# Altium project 03_POWER.PrjPCB
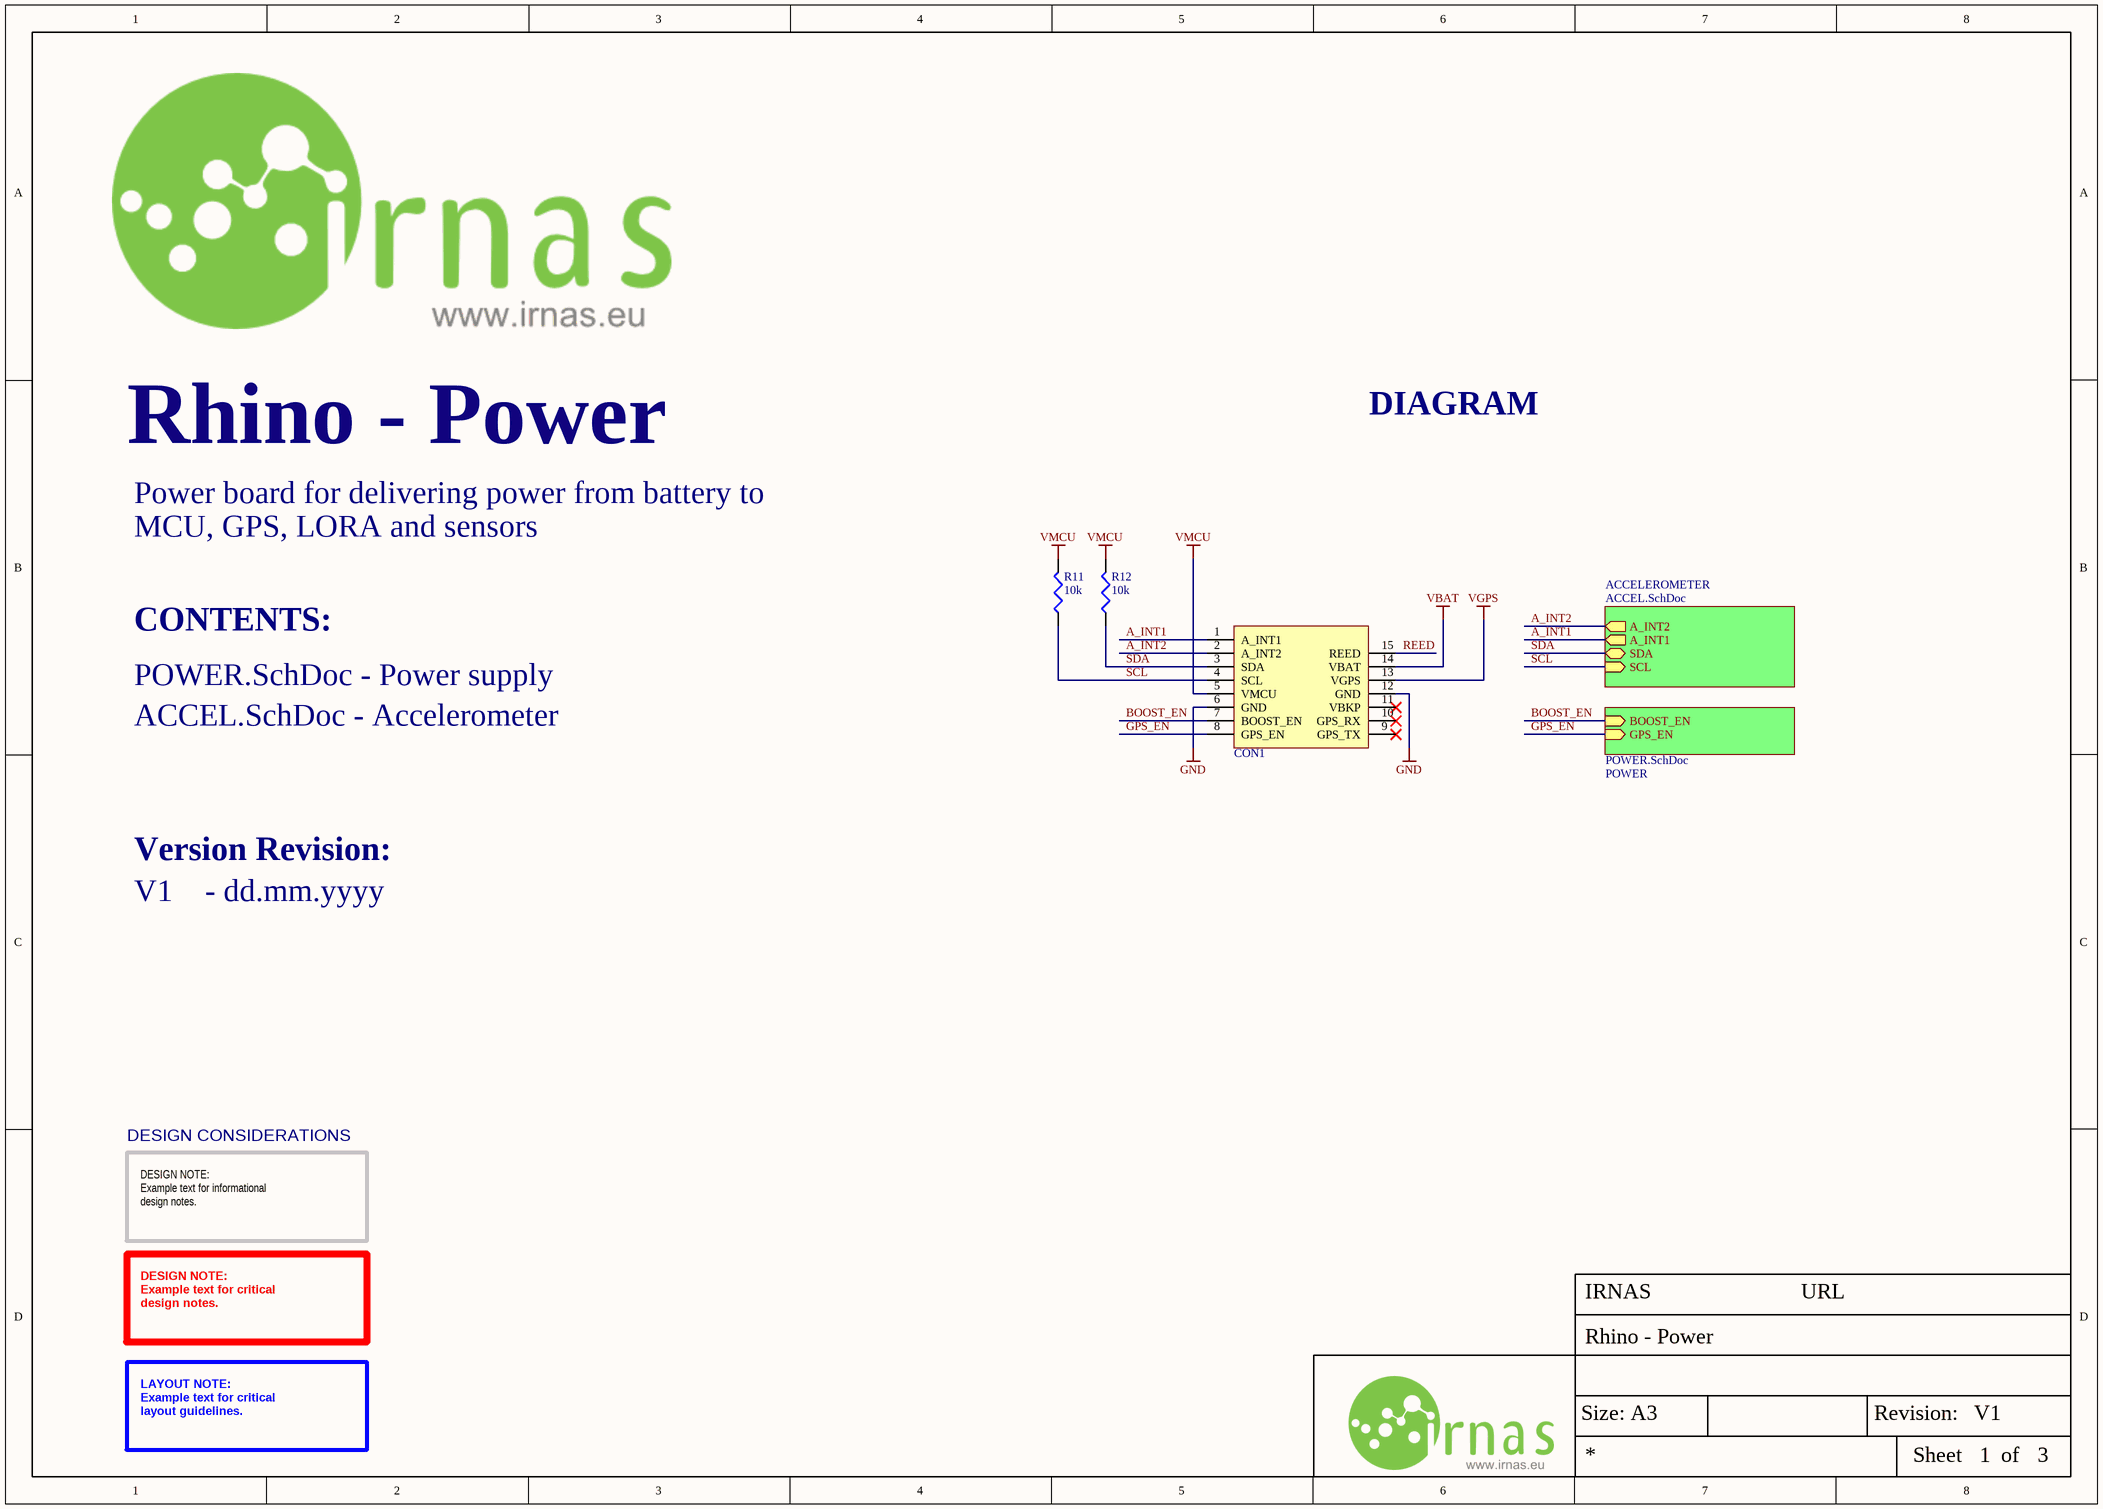
[diagram p0: MAIN_POWER.SchDoc]
Company: IRNAS; CreateDate: 13.05.2019; PCBDesigner: Aleksej Cegner; ProjectTitle: Rhino - Power; RevisionDate: dd.mm.yyyy; Version: V1; Website: URL
3 sheets, 36 parts. Net scope: hierarchical (ports join the sheet entries above them; power ports are global).
Board file: POWER.PcbDoc
Sheets:
  MAIN_POWER.SchDoc
    POWER = POWER.SchDoc
    ACCELEROMETER = ACCEL.SchDoc

## Sheet MAIN_POWER.SchDoc
size A3; DocumentNumber: 1; SheetNumber: 1; SheetTotal: 3

### Parts
CON1  Between PCB connection  [SmartParks_Rhino]  (value not drawn)
R11  10k  [RES0402]
R12  10k  [RES0402]

### Sub-sheets
ACCELEROMETER = ACCEL.SchDoc: A_INT1 (out), SCL (in), SDA (bidir), A_INT2 (out)
POWER = POWER.SchDoc: GPS_EN (in), BOOST_EN (in)

### Nets
GND: CON1.6(GND) CON1.12(GND)
VBAT: CON1.14(VBAT)
VGPS: CON1.13(VGPS)
VMCU: CON1.5(VMCU) R11.2 R12.2
A_INT1: CON1.1(A_INT1) ; sheet ACCELEROMETER/A_INT1
A_INT2: CON1.2(A_INT2) ; sheet ACCELEROMETER/A_INT2
BOOST_EN: CON1.7(BOOST_EN) ; sheet POWER/BOOST_EN
GPS_EN: CON1.8(GPS_EN) ; sheet POWER/GPS_EN
REED: CON1.15(REED)
SCL: CON1.4(SCL) R11.1 ; sheet ACCELEROMETER/SCL
SDA: CON1.3(SDA) R12.1 ; sheet ACCELEROMETER/SDA

Not connected (* = marked no-connect by the designer): CON1 9(GPS_TX)* 10(GPS_RX)* 11(VBKP)*

### Notes on the sheet
- DIAGRAM
- Power board for delivering power from battery to
- MCU, GPS, LORA and sensors
- CONTENTS:
- POWER.SchDoc - Power supply
- ACCEL.SchDoc - Accelerometer
- Version Revision:
- V1    - dd.mm.yyyy
- DESIGN CONSIDERATIONS
- DESIGN NOTE:
  Example text for informational
  design notes.
- DESIGN NOTE:
  Example text for critical
  design notes.
- LAYOUT NOTE:
  Example text for critical
  layout guidelines.
- Size: A3
- Revision:
- Sheet
- of

### Library data of the parts
CON1 = SmartParks_Rhino
R11 R12 = R - 10k/0402: MULTICOMP         MCWR04X1002FTL             SMD Chip Resistor, Thick Film, 10 kohm, 50 V, 0402 [1005 Metric], 62.5 mW,  1%, MCWR Series; IRNAS Part No.: I-100014; Resistance: 10kR; Voltage Rating: 50V; Power Rating: 62.5mW; Temperature Coefficient: 100ppm/°C; Supplier 1: Farnell; Manufacturer: Multicomp; Manufacturer Part Number: MCWR04X1002FTL; Stock 1: 602609; Pricing 1: 10=0.0029, 100=0.0017, 500=0.0012, 2500=0.001, 5000=0.0008 (EUR); Case/Package: 0402; Case Code (Metric): 1005; Case Code (Imperial): 0402; Packaging: Cut Tape; Composition: Thick Film; Tolerance: 1%; Voltage Rating (DC): 50V; REACH SVHC: No SVHC; ComponentLink1URL: http://www.farnell.com/datasheets/1849611.pdf; ComponentLink1Description: http://www.farnell.com/datasheets/1849611.pdf; Supplier Part Number 1: 2447096

## Sheet POWER.SchDoc
size A3; DocumentNumber: 2; SheetNumber: 2; SheetTotal: 3
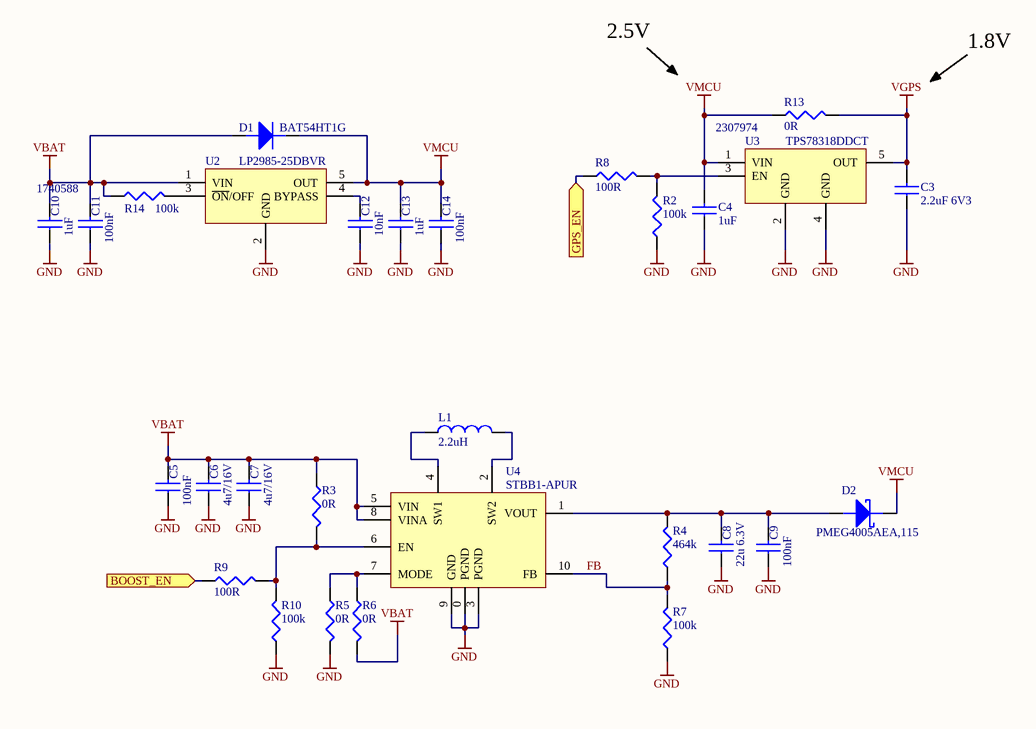
[diagram p1: POWER.SchDoc]

### Parts
C3  2.2uF 6V3  [CAP0402]
C4  1uF  [CAP0402]
C5  100nF  [CAP0402]
C6  4u7/16V  [CAP0603]
C7  4u7/16V  [CAP0603]
C8  22u 6.3V  [CAP0805]
C9  100nF  [CAP0402]
C10  1uF  Supplier Part Number 1: 1740588  [CAP0402]
C11  100nF  [CAP0402]
C12  10nF  [CAP0402]
C13  1uF  [CAP0402]
C14  100nF  [CAP0402]
D1  BAT54HT1G  [SOD-323 2L]
D2  PMEG4005AEA,115  [SOD-323 2L]
L1  2.2uH  [IND2.3X1.7]
R2  100k  [RES0402]
R3  0R  [RES0402]
R4  464k  [RES0402]
R5  0R  [RES0402]
R6  0R  [RES0402]
R7  100k  [RES0402]
R8  100R  [RES0402]
R9  100R  [RES0402]
R10  100k  [RES0402]
R13  0R  [RES0402]
R14  100k  [RES0402]
U2  LP2985-25DBVR  [SOT23-5]
U3  TPS78318DDCT  Supplier Part Number 1: 2307974  [SOT23-5]
U4  STBB1-APUR  [DFN-10]

### Ports
BOOST_EN (in), GPS_EN (in)

### Nets
GND: C3.1 C4.1 C5.1 C6.1 C7.1 C8.1 C9.1 C10.1 C11.1 C12.1 C13.1 C14.1 R2.1 R5.2 R7.1 R10.1 U2.2(GND) U3.2(GND) U3.4(GND) U4.0(PGND) U4.3(PGND) U4.9(GND)
VBAT: C5.2 C6.2 C7.2 C10.2 C11.2 D1.2(ANODE) R3.1 R6.2 R14.1 U2.1(VIN) U4.5(VIN) U4.8(VINA)
VGPS: C3.2 R13.2 U3.5(OUT)
VMCU: C4.2 C13.2 C14.2 D1.1(cathode) D2.1(cathode) R13.1 U2.5(OUT) U3.1(VIN)
BOOST_EN: R9.1 ; port BOOST_EN
FB: R4.1 R7.2 U4.10(FB)
GPS_EN: R8.1 ; port GPS_EN
NetC8_2: C8.2 C9.2 D2.2(ANODE) R4.2 U4.1(VOUT)
NetC12_2: C12.2 U2.4(BYPASS)
NetL1_1: L1.1 U4.4(SW1)
NetL1_2: L1.2 U4.2(SW2)
NetR2_2: R2.2 R8.2 U3.3(EN)
NetR3_2: R3.2 R9.2 R10.2 U4.6(EN)
NetR5_1: R5.1 R6.1 U4.7(MODE)
NetR14_2: R14.2 U2.3(~{ON}/OFF)

### Notes on the sheet
- 2.5V
- 1.8V
- Size: A3
- Revision:
- Sheet
- of

### Library data of the parts
C3 = C - 2.2uF/6V3/0402: CAP CER 2.2UF 6.3V 20% X5R 0402; Manufacturer: Murata; Manufacturer Part Number: GRM155R60J225ME15D; IRNAS Part No.: /; Material: Ceramic; Stock 1: 0; Pricing 1: 10=0.118, 100=0.0494, 500=0.031, 2500=0.0213, 5000=0.0163 (EUR); Mount: Surface Mount; Case/Package: 0402; Case Code (Metric): 1005; Case Code (Imperial): 0402; Min Operating Temperature: -55°C; Max Operating Temperature: 85°C; Packaging: Tape and Reel; Capacitance: 2.2uF; Tolerance: 20%; Package Quantity: 10000; Voltage Rating: 6.3V; Voltage Rating (DC): 6.3V; Dielectric: X5R; Termination: SMD/SMT; Voltage: 6.3V; Length: 1mm; Height: 0.5mm; Width: 0.02inch; Thickness: 0.022inch; Depth: 0.5mm; Radiation Hardening: No; REACH SVHC: No SVHC; Lead Free: Lead Free; ComponentLink1URL: https://datasheet.ciiva.com/29149/450128-da-01-de-vs-kondens-grm155-r60j-225me15d-29149006.pdf; ComponentLink1Description: https://datasheet.ciiva.com/29149/450128-da-01-de-vs-kondens-grm155-r60j-225me15d-29149006.pdf; ComponentLink2URL: https://datasheet.ciiva.com/46418/1754686-46418042.pdf; ComponentLink2Description: https://datasheet.ciiva.com/46418/1754686-46418042.pdf; ComponentLink3URL: https://datasheet.ciiva.com/17454/c02e-17454956.pdf; ComponentLink3Description: https://datasheet.ciiva.com/17454/c02e-17454956.pdf; ComponentLink4URL: https://datasheet.ciiva.com/235/partnumbering-e-01-235009.pdf; ComponentLink4Description: https://datasheet.ciiva.com/235/partnumbering-e-01-235009.pdf; ComponentLink5URL: https://datasheet.ciiva.com/2989/c02e-2989361.pdf; ComponentLink5Description: https://datasheet.ciiva.com/2989/c02e-2989361.pdf; ComponentLink6URL: https://datasheet.ciiva.com/235/partnumbering-e-01-235010.pdf; ComponentLink6Description: https://datasheet.ciiva.com/235/partnumbering-e-01-235010.pdf; ComponentLink7URL: https://datasheet.ciiva.com/235/partnumbering-e-01-235011.pdf; ComponentLink7Description: https://datasheet.ciiva.com/235/partnumbering-e-01-235011.pdf; Supplier 1: Farnell; Supplier Part Number 1: 2362088
C4 C10 C13 = C - 1uF/0402: CAP CER 1UF 10V 20% X5R 0402; Manufacturer: Murata; Manufacturer Part Number: GRM155R61A105ME15D; IRNAS Part No.: /; Stock 1: 0; Pricing 1: 10=0.0379, 100=0.0266, 500=0.0156, 2500=0.0098, 5000=0.0083 (EUR); Mount: Surface Mount; Case/Package: 0402; Case Code (Metric): 1005; Case Code (Imperial): 0402; Min Operating Temperature: -55°C; Max Operating Temperature: 85°C; Capacitance: 1uF; Tolerance: 20%; Voltage Rating: 10V; Packaging: Tape and Reel; Package Quantity: 1; Dielectric: X5R; Voltage: 10V; Voltage Rating (DC): 10V; Length: 1mm; Height: 0.5mm; Width: 0.02inch; Thickness: 0.022inch; Depth: 0.5mm; Radiation Hardening: No; REACH SVHC: No SVHC; Lead Free: Lead Free; ComponentLink1URL: https://datasheet.ciiva.com/164/product-164665.pdf; ComponentLink1Description: https://datasheet.ciiva.com/164/product-164665.pdf; ComponentLink2URL: https://datasheet.ciiva.com/11616/product-11616508.pdf; ComponentLink2Description: https://datasheet.ciiva.com/11616/product-11616508.pdf; ComponentLink3URL: https://datasheet.ciiva.com/46418/1769893-46418047.pdf; ComponentLink3Description: https://datasheet.ciiva.com/46418/1769893-46418047.pdf; ComponentLink4URL: https://datasheet.ciiva.com/164/partnumbering-e-01-164666.pdf; ComponentLink4Description: https://datasheet.ciiva.com/164/partnumbering-e-01-164666.pdf; ComponentLink5URL: https://datasheet.ciiva.com/164/partnumbering-e-01-164667.pdf; ComponentLink5Description: https://datasheet.ciiva.com/164/partnumbering-e-01-164667.pdf; Supplier 1: Farnell
  C4 C13: Supplier Part Number 1: 1740588
C5 C9 C11 C14 = C - 100nF/0402: MULTICOMP         MC0402X104J160CT             SMD Multilayer Ceramic Capacitor, 0402 [1005 Metric], 0.1 F, 16 V,  5%, X5R, MC Series                          New; IRNAS Part No.: /; Voltage Rating: 16V; Supplier 1: Farnell; Manufacturer: Multicomp; Manufacturer Part Number: MC0402X104J160CT; Stock 1: 3230; Pricing 1: 10=0.0139, 100=0.0108, 500=0.0076, 2500=0.0051, 5000=0.0038 (EUR); Case Code (Metric): 1005; Case Code (Imperial): 0402; Min Operating Temperature: -55°C; Max Operating Temperature: 85°C; Capacitance: 100nF; Dielectric: X5R; Packaging: Tape and Reel; Tolerance: 5%; Voltage Rating (DC): 16V; REACH SVHC: No SVHC; ComponentLink1URL: http://www.farnell.com/datasheets/2117933.pdf; ComponentLink1Description: http://www.farnell.com/datasheets/2117933.pdf; ComponentLink2URL: http://www.farnell.com/datasheets/2117900.pdf; ComponentLink2Description: http://www.farnell.com/datasheets/2117900.pdf; Supplier Part Number 1: 2627419
C6 C7 = C - 4u7  16V 0603: MURATA - GRM188R61C475KAAJD - CAP, MLCC, X5R, 4.7UF, 16V, 0603; IRNAS Part No.: I-200001; Ceramic Capacitor Case: 0603 [1608 Metric]; Capacitance: 4.7; Voltage Rating: 16; Capacitance Tolerance: ± 10%; Dielectric Characteristic: X5; Product Range: GRM Series; SVHC: No SVHC (17-Dec-2015)<!--FANDB--><div class="features-and-benefits-container"><div class="features-and-benefits-desc-container"><span class="features-and-benefits-container-desc">SMD Multilayer Ceramic Capacitor, 0603 [1608 Metric], 4.7 µF, 16 V, ± 10%, X5; Supplier 1: Farnell; Manufacturer: MURATA; Manufacturer Part Number: GRM188R61C475KAAJD; RoHS: YES; Stock 1: 5038; Pricing 1: 10=0.16, 100=0.0929, 500=0.076, 1000=0.0618, 2000=0.0605, 4000=0.0425, 20000=0.0409, 40000=0.0355 (GBP); Packaging: Cut Tape; Operating Temperature Min: -55; Operating Temperature Max: 85; Automotive Qualification Standard: -; MSL: MSL 1 - Unlimited; ComponentLink1URL: http://www.farnell.com/datasheets/2079168.pdf; ComponentLink1Description: http://www.farnell.com/datasheets/2079168.pdf; Supplier Part Number 1: 2611924
C8 = C - 22u 6.3V 0805: MULTICOMP - MC0805X226M6R3CT - CAP, MLCC, X5R, 22UF, 0805; IRNAS Part No.: I-200008; Ceramic Capacitor Case: 0805 [2012 Metric]; Capacitance: 22; Voltage Rating: 6.3; Capacitance Tolerance: ± 20%; Dielectric Characteristic: X5; Product Range: MC Series; SVHC: No SVHC (07-Jul-2017); Capacitor Terminals: SMD; Manufacturer: MULTICOMP; Manufacturer Part Number: MC0805X226M6R3CT; RoHS: YES; Stock 1: 74736; Pricing 1: 5=0.128, 50=0.0738, 250=0.0507, 500=0.042, 1500=0.0358 (GBP); Packaging: Cut Tape; Operating Temperature Min: -55; Operating Temperature Max: 85; Automotive Qualification Standard: -; MSL: -; Capacitance Tolerance ±: ± 20%; Operating Temperature Range: -55°C to +85°C<!--FANDB--><div class="features-and-benefits-container"><div class="features-and-benefits-desc-container"><span class="features-and-benefits-container-desc">SMD Multilayer Ceramic Capacitor, 0805 [2012 Metric], 22 µF, 6.3 V, ± 20%, X5R, MC Series</span></div><div class="features-and-benefits-description"><span class="features-benefits-value">The Multicomp MC series is general purpose MLCC capacitors with X5R dielectric material which provides high electrical precision, stability and reliability. This MLCC capacitor consists of a conducting material and electrodes with high density and high efficiency ceramic condensers.</span></div><div class="features-and-benefits-list"><ul class="features-and-benefits-list-list"><li class="features-and-benefits-list-item">Small size with higher capacitance values</li><li class="features-and-benefits-list-item">0201, 0402, 0603, 0805, 1206, 1210, 1812 case sizes available</li><li class="features-and-benefits-list-item">Capacitance value ranging from 100pF to 220?F</li><li class="features-and-benefits-list-item">Capacitor with lead free termination (pure Tin)</li><li class="features-and-benefits-list-item">High electrical precision, stability and reliability</li><li class="features-and-benefits-list-item">Rated voltage of 4V, 6.3V, 10V, 16V, 25V, 50V</li><li class="features-and-benefits-list-item">Operating temperature of -55°C to +85°C</li><li class="features-and-benefits-list-item">Available in ±10% and ±20; ComponentLink1URL: http://www.farnell.com/datasheets/1901289.pdf; ComponentLink1Description: http://www.farnell.com/datasheets/1901289.pdf; ComponentLink2URL: http://www.farnell.com/datasheets/1932399.pdf; ComponentLink2Description: http://www.farnell.com/datasheets/1932399.pdf; Supplier 1: Farnell; Supplier Part Number 1: 2611932
C12 = C - 10nF/0402: CAP CER 10000PF 16V X7R 0402; Manufacturer: Murata; Manufacturer Part Number: GRM155R71C103KA01D; IRNAS Part No.: /; Tolerance: 10%; Stock 1: 16478; Pricing 1: 10=0.0216, 100=0.0151, 500=0.0104, 2500=0.0069, 5000=0.0056 (EUR); Mount: Surface Mount; Case/Package: 0402; Number of Pins: 2; Case Code (Metric): 1005; Case Code (Imperial): 0402; Min Operating Temperature: -55°C; Max Operating Temperature: 125°C; Package Quantity: 1; Capacitance: 10nF; Voltage Rating: 16V; Packaging: Tape and Reel; Voltage Rating (DC): 16V; Dielectric: X7R; Termination: SMD/SMT; Voltage: 16V; Length: 1mm; Height: 0.5mm; Width: 0.02inch; Thickness: 0.022inch; Depth: 0.5mm; Radiation Hardening: No; REACH SVHC: No SVHC; Lead Free: Lead Free; ComponentLink1URL: https://datasheet.ciiva.com/129/partnumbering-e-01-129774.pdf; ComponentLink1Description: https://datasheet.ciiva.com/129/partnumbering-e-01-129774.pdf; ComponentLink2URL: https://datasheet.ciiva.com/129/partnumbering-e-01-129775.pdf; ComponentLink2Description: https://datasheet.ciiva.com/129/partnumbering-e-01-129775.pdf; ComponentLink3URL: https://datasheet.ciiva.com/129/product-129776.pdf; ComponentLink3Description: https://datasheet.ciiva.com/129/product-129776.pdf; ComponentLink4URL: https://datasheet.ciiva.com/18184/getdatasheetpartid-178863-18184649.pdf; ComponentLink4Description: https://datasheet.ciiva.com/18184/getdatasheetpartid-178863-18184649.pdf; ComponentLink5URL: https://datasheet.ciiva.com/22698/608985-22698415.pdf; ComponentLink5Description: https://datasheet.ciiva.com/22698/608985-22698415.pdf; ComponentLink6URL: https://datasheet.ciiva.com/7937/608985-7937614.pdf; ComponentLink6Description: https://datasheet.ciiva.com/7937/608985-7937614.pdf; Supplier 1: Farnell; Supplier Part Number 1: 3019275
D1 = DS - BAT54HT1G: FAIRCHILD SEMICONDUCTOR - BAT54HT1G - DIODE, SCHOTTKY, 30V, SOD-323; Diode Configuration: Single; Repetitive Reverse Voltage Vrrm Max: 30; Forward Current If(AV): 200; Forward Voltage VF Max: 800; Forward Surge Current Ifsm Max: 600; No. of Pins: 2; Product Range: BAT54 Series; SVHC: No SVHC (15-Jun-2015); Reverse Recovery Time trr Max: 5ns<!--FANDB--><div class="features-and-benefits-container"><div class="features-and-benefits-description"><span class="features-benefits-value">The BAT54HT1G is a Schottky Barrier Diode for general usage and suitable for many different applications.</span></div><div class="features-and-benefits-list"><ul class="features-and-benefits-list-list"><li class="features-and-benefits-list-item">-65 to 150°C Storage temperature range</li><li class="features-and-benefits-list-item">-55 to 150; Supplier 1: Farnell; Manufacturer: FAIRCHILD SEMICONDUCTOR; Manufacturer Part Number: BAT54HT1G; RoHS: YES; Stock 1: 5495; Pricing 1: 1=0.0747, 250=0.065, 500=0.055, 1000=0.045, 3000=0.0349, 9000=0.0279 (GBP); Operating Temperature Max: 150; Diode Case Style: SOD-323; Packaging: Cut Tape; Automotive Qualification Standard: -; MSL: MSL 1 - Unlimited; ComponentLink1URL: http://www.farnell.com/datasheets/2251626.pdf; ComponentLink1Description: http://www.farnell.com/datasheets/2251626.pdf; Supplier Part Number 1: 2453769
D2 = DS - PMEG4005AEA,115: Schottky Rectifier, 40 V, 500 mA, Single; Manufacturer: MICRO COMMERCIAL COMPONENTS; Manufacturer Part Number: SK34A-TP; RoHS: Y-EX; Stock 1: 3770; Pricing 1: 1=0.736, 10=0.574, 100=0.395, 250=0.328, 500=0.309, 1000=0.287, 5000=0.252, 10000=0.214 (GBP); ComponentLink1URL: D:\altium\Altium_Library\Active\Datasheet\PMEG4005AEA.pdf; ComponentLink1Description: Datasheet; Supplier 1: Farnell; Supplier Part Number 1: 8738025
L1 = L - 2.2 uH 900mA: Manufacturer: Bourns; Manufacturer Part Number: SRN2009T-2R2M; IRNAS Part No.: /; Supplier 1: Farnell; Stock 1: 1975; Pricing 1: 5=0.308, 50=0.201, 250=0.163, 500=0.145, 1000=0.133, 2000=0.124, 10000=0.116 (EUR); Supplier Part Number 1: 2808272
R2 R7 R10 R14 = R - 100k/0402: MULTICOMP   MCWR04X1003FTL   RES, THICK FILM, 100KOHM, 1%, 0.0625W; IRNAS Part No.: I-100013; Resistance: 100kR; Power Rating: 62.5mW; Voltage Rating: 50V; Temperature Coefficient: 100ppm/°C; Supplier 1: Farnell; Manufacturer: Multicomp; Manufacturer Part Number: MCWR04X1003FTL; Stock 1: 161188; Pricing 1: 10=0.0029, 100=0.0017, 500=0.0012, 2500=0.001, 5000=0.0008 (EUR); Mount: Surface Mount; Case/Package: 0402; Case Code (Metric): 1005; Case Code (Imperial): 0402; Tolerance: 1%; Packaging: Cut Tape; Composition: Thick Film; Voltage Rating (DC): 50V; REACH SVHC: No SVHC; ComponentLink1URL: https://datasheet.ciiva.com/46386/1849611-46386524.pdf; ComponentLink1Description: https://datasheet.ciiva.com/46386/1849611-46386524.pdf; Supplier Part Number 1: 2447094
R3 R5 R6 R13 = R - 0R/0402: RESISTOR, 0402, 0R, ANTI SULFURATION; Manufacturer: Multicomp; Manufacturer Part Number: MCMR04X000PTL; IRNAS Part No.: I-100016; Voltage Rating: 50V; Resistance: 0mR; Power Rating: 62.5mW; Temperature Coefficient: 400ppm/°C; Supplier 1: Farnell; Stock 1: 0; Pricing 1: 10=0.0057, 100=0.0034, 500=0.0024, 2500=0.0019, 5000=0.0015 (EUR); Case/Package: 0402; Case Code (Metric): 1005; Case Code (Imperial): 0402; Packaging: Cut Tape; Composition: Ceramic; Voltage Rating (DC): 50V; REACH SVHC: No SVHC; ComponentLink1URL: https://datasheet.ciiva.com/7776/1716705-7776974.pdf; ComponentLink1Description: https://datasheet.ciiva.com/7776/1716705-7776974.pdf; ComponentLink2URL: https://datasheet.ciiva.com/28677/1716705-28677161.pdf; ComponentLink2Description: https://datasheet.ciiva.com/28677/1716705-28677161.pdf; Supplier Part Number 1: 2072513
R4 = R - 402k: MULTICOMP - MC0063W06031402K - RES, THICK FILM, 402K, 1%, 0.063W, 0603; IRNAS Part No.: /; Resistance: 402; Voltage Rating: 50; Resistor Case Style: 0603 [1608 Metric]; Power Rating: 63; Product Range: MC Series; Temperature Coefficient: ± 100; SVHC: No SVHC (12-Jan-2017); Reel Quantity: 5000; Resistor Mounting: Surface Mount Device<!--FANDB--><div class="features-and-benefits-container"><div class="features-and-benefits-desc-container"><span class="features-and-benefits-container-desc">SMD Chip Resistor, Thick Film, 402 kohm, 50 V, 0603 [1608 Metric], 63 mW, ± 1%, MC Series</span></div><div class="features-and-benefits-description"><span class="features-benefits-value">The Multicomp MC series current sense resistors are thick film chip resistors. The resistance range includes E96 and E24 decade values from 1ohm to 10Mohm.</span></div><div class="features-and-benefits-list"><ul class="features-and-benefits-list-list"><li class="features-and-benefits-list-item">EIA 0402, 0603, 0805, 1206 chip sizes available</li><li class="features-and-benefits-list-item">Small size and low weight</li><li class="features-and-benefits-list-item">Suitable for both wave and reflow soldering</li><li class="features-and-benefits-list-item">Reduction of assembly costs</li><li class="features-and-benefits-list-item">Maximum working voltage of 50V(0402, 0603), 150V(0805), 200V(1206)</li><li class="features-and-benefits-list-item">Available in ±1%, ±2% and ±5% tolerance</li><li class="features-and-benefits-list-item">Power rating of 62.5mW, 100mW and 125mW</li><li class="features-and-benefits-list-item">±400ppm/°C(1ohm to 10ohm), ±200ppm/°C(11ohm to 100ohm), ±100; Manufacturer: MULTICOMP; Manufacturer Part Number: MC0063W06031402K; RoHS: Y-EX; Stock 1: 104996; Pricing 1: 5000=0.0007, 25000=0.0006, 50000=0.0005 (GBP); Resistance Tolerance: ± 1%; Packaging: Tape & Reel; Resistor Element Material: Thick Film; Automotive Qualification Standard: -; ComponentLink1URL: http://www.farnell.com/datasheets/1788326.pdf; ComponentLink1Description: http://www.farnell.com/datasheets/1788326.pdf; ComponentLink2URL: http://www.farnell.com/datasheets/1944283.pdf; ComponentLink2Description: http://www.farnell.com/datasheets/1944283.pdf; Supplier 1: Farnell; Supplier Part Number 1: 2141001
R8 R9 = R - 100R/0402: MULTICOMP         MCMR04X1000FTL            SMD Chip Resistor, Ceramic, MCMR Series, 100 ohm, 50 V, 0402 [1005 Metric], 62.5 mW,  1%; IRNAS Part No.: /; Temperature Coefficient: 100ppm/°C; Power Rating: 62.5mW; Voltage Rating: 50V; Supplier 1: Farnell; Manufacturer: Multicomp; Manufacturer Part Number: MCMR04X1000FTL; Stock 1: 62365; Pricing 1: 10=0.0071, 100=0.0042, 500=0.003, 2500=0.0024, 5000=0.0019 (GBP); Case/Package: 0402; Case Code (Metric): 1005; Case Code (Imperial): 0402; Resistance: 100R; Tolerance: 1%; Composition: Ceramic; Packaging: Cut Tape; Voltage Rating (DC): 50V; REACH SVHC: No SVHC; ComponentLink1URL: https://datasheet.ciiva.com/28692/1716705-28692087.pdf; ComponentLink1Description: https://datasheet.ciiva.com/28692/1716705-28692087.pdf; ComponentLink2URL: https://datasheet.ciiva.com/22708/1716705-22708156.pdf; ComponentLink2Description: https://datasheet.ciiva.com/22708/1716705-22708156.pdf; Supplier Part Number 1: 2072515
U2 = V_LIN - LP2985-25DBVR: Fixed LDO Voltage Regulator, 2.2V to 16V, 280mV Dropout, 2.5Vout, 150mAout; Manufacturer: ON SEMICONDUCTOR; Manufacturer Part Number: LM2596DSADJG; Topology: Buck (Step Down); Input Voltage Min: 4.5; Input Voltage Max: 45; No. of Outputs: 1; DC / DC Converter IC Case: TO-263; No. of Pins: 5; Output Current: 3; Output Voltage Min: 1.23; Output Voltage Max: 37; Switching Frequency: 150; SVHC: No SVHC (12-Jan-2017; RoHS: YES; Stock 1: 342; Pricing 1: 1=1.98, 10=1.49, 100=1.19, 500=1.04, 1000=0.859, 2500=0.785 (GBP); Operating Temperature Max: 125; Packaging: Each; Product Range: -; Automotive Qualification Standard: -; MSL: MSL 1 - Unlimited; ComponentLink1URL: http://www.farnell.com/datasheets/2031954.pdf; ComponentLink1Description: http://www.farnell.com/datasheets/2031954.pdf; Supplier 1: Farnell; Supplier Part Number 1: 2492273
U3 = V_LIN - TPS78318DDCT: Fixed LDO Voltage Regulator, 2.2V to 5.5V, 130mV Dropout, 1.8Vout, 150mAout; Manufacturer: ON SEMICONDUCTOR; Manufacturer Part Number: LM2596DSADJG; Topology: Buck (Step Down); Input Voltage Min: 4.5; Input Voltage Max: 45; No. of Outputs: 1; DC / DC Converter IC Case: TO-263; No. of Pins: 5; Output Current: 3; Output Voltage Min: 1.23; Output Voltage Max: 37; Switching Frequency: 150; SVHC: No SVHC (12-Jan-2017; RoHS: YES; Stock 1: 342; Pricing 1: 1=1.98, 10=1.49, 100=1.19, 500=1.04, 1000=0.859, 2500=0.785 (GBP); Operating Temperature Max: 125; Packaging: Each; Product Range: -; Automotive Qualification Standard: -; MSL: MSL 1 - Unlimited; ComponentLink1URL: http://www.farnell.com/datasheets/2031954.pdf; ComponentLink1Description: http://www.farnell.com/datasheets/2031954.pdf; Supplier 1: Farnell
U4 = V_SW - STBB1-APUR: DC-DC Switching Buck-Boost Regulator, Adjustable, 2V-5.5Vin, 1.2V-5.5Vout, 1Aout; Manufacturer: u-blox; Manufacturer Part Number: MAX-M8Q-0; Stock 1: 10805; ComponentLink1Description: Datasheet; ComponentLink1URL: D:\altium\Altium_Library\Active\Datasheet\stbb-axx.pdf; Supplier 1: Farnell; Supplier Part Number 1: 2473965

## Sheet ACCEL.SchDoc
size A3; DocumentNumber: 3; SheetNumber: 3; SheetTotal: 3
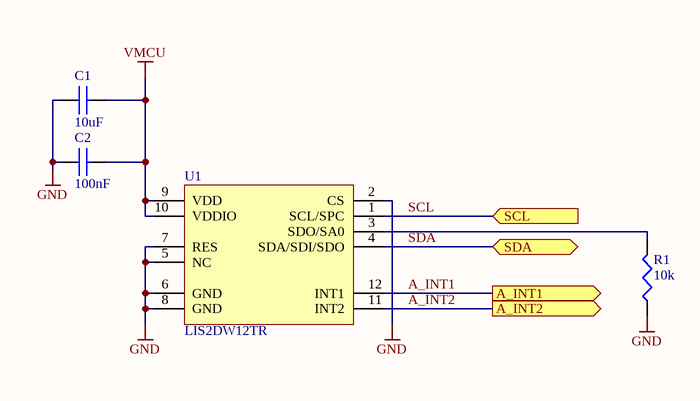
[diagram p2: ACCEL.SchDoc]

### Parts
C1  10uF  [CAP0603]
C2  100nF  [CAP0402]
R1  10k  [RES0402]
U1  LIS2DW12TR  [LGA-12]

### Ports
A_INT1 (out), A_INT2 (out), SCL (in), SDA (bidir)

### Nets
GND: C1.1 C2.1 R1.1 U1.2(CS) U1.5(NC) U1.6(GND) U1.7(RES) U1.8(GND)
VMCU: C1.2 C2.2 U1.9(VDD) U1.10(VDDIO)
A_INT1: U1.12(INT1) ; port A_INT1
A_INT2: U1.11(INT2) ; port A_INT2
SCL: U1.1(SCL/SPC) ; port SCL
SDA: U1.4(SDA/SDI/SDO) ; port SDA
NetR1_2: R1.2 U1.3(SDO/SA0)

### Notes on the sheet
- Size: A3
- Revision:
- Sheet
- of

### Library data of the parts
C1 = C - 10uF/10V: Cap Ceramic 10uF 10V X5R 10% SMD 0603 85C Paper T/R; Manufacturer: Samsung; Manufacturer Part Number: CL10A106KP8NNNC; IRNAS Part No.: /; Stock 1: 2844657; Pricing 1: 1=0.36, 10=0.248, 100=0.1403, 500=0.099, 1000=0.08663 (USD); Mount: Surface Mount; Case/Package: 0603; Case Code (Metric): 1608; Case Code (Imperial): 0603; Material: Ceramic; Contact Plating: Tin; Min Operating Temperature: -55°C; Max Operating Temperature: 85°C; Capacitance: 10uF; Tolerance: 10%; Package Quantity: 1; Packaging: Tape and Reel; Voltage Rating: 10V; Dielectric: X5R; Voltage Rating (DC): 10V; Length: 1.6mm; Height: 0.8mm; Width: 0.031inch; Thickness: 0.035inch; Depth: 0.8mm; Radiation Hardening: No; Lead Free: Lead Free; ComponentLink1URL: https://www.verical.com/server-webapp/html/getDatasheet?partID=359551; ComponentLink1Description: https://www.verical.com/server-webapp/html/getDatasheet?partID=359551; ComponentLink2URL: http://www1.futureelectronics.com/doc/SAMSUNG%20PASSIVE/CL05B104KQ5NNNC.pdf; ComponentLink2Description: http://www1.futureelectronics.com/doc/SAMSUNG%20PASSIVE/CL05B104KQ5NNNC.pdf; ComponentLink3URL: https://produktinfo.conrad.com/datenblaetter/450000-474999/457369-da-01-en-VS_KONDENSATOR_0603.pdf; ComponentLink3Description: https://produktinfo.conrad.com/datenblaetter/450000-474999/457369-da-01-en-VS_KONDENSATOR_0603.pdf; Supplier 1: Farnell; Supplier Part Number 1: 2456110
C2 = C - 100nF/0402: as C5 on sheet POWER; Supplier 1: Farnell; Manufacturer: Multicomp; Manufacturer Part Number: MC0402X104J160CT; Stock 1: 3230; Pricing 1: 10=0.0139, 100=0.0108, 500=0.0076, 2500=0.0051, 5000=0.0038 (EUR); Case Code (Metric): 1005; Case Code (Imperial): 0402; Min Operating Temperature: -55°C; Max Operating Temperature: 85°C; Capacitance: 100nF; Dielectric: X5R; Packaging: Tape and Reel; Tolerance: 5%; Voltage Rating (DC): 16V; REACH SVHC: No SVHC; ComponentLink1URL: http://www.farnell.com/datasheets/2117933.pdf; ComponentLink1Description: http://www.farnell.com/datasheets/2117933.pdf; ComponentLink2URL: http://www.farnell.com/datasheets/2117900.pdf; ComponentLink2Description: http://www.farnell.com/datasheets/2117900.pdf; Supplier Part Number 1: 2627419
R1 = R - 10k/0402: as R11 on sheet MAIN_POWER; Supplier 1: Farnell; Manufacturer: Multicomp; Manufacturer Part Number: MCWR04X1002FTL; Stock 1: 602609; Pricing 1: 10=0.0029, 100=0.0017, 500=0.0012, 2500=0.001, 5000=0.0008 (EUR); Case/Package: 0402; Case Code (Metric): 1005; Case Code (Imperial): 0402; Packaging: Cut Tape; Composition: Thick Film; Tolerance: 1%; Voltage Rating (DC): 50V; REACH SVHC: No SVHC; ComponentLink1URL: http://www.farnell.com/datasheets/1849611.pdf; ComponentLink1Description: http://www.farnell.com/datasheets/1849611.pdf; Supplier Part Number 1: 2447096
U1 = SEN - LIS2DW12TR: MEMS Accelerometer, Digital, X, Y, Z, ± 2g, ± 4g, ± 8g, ± 16g, 1.62 V, 3.6 V; Manufacturer: TDK InvenSense; Interface: I2C; Max Supply Voltage: 3.6V; Min Supply Voltage: 2.4V; Output Type: SPI; Manufacturer Part Number: MPU-9250; Stock 1: 0; RoHS: Yes; Mount: Surface Mount; Case/Package: QFN; Number of Pins: 24; Min Operating Temperature: -40°C; Max Operating Temperature: 85°C; Package Quantity: 1; Sensor Type: Accelerometer; Length: 3.1mm; Height: 1mm; Width: 3.1mm; ComponentLink1Description: Datasheet; ComponentLink1URL: D:\altium\Altium_Library\Active\Datasheet\LIS2DW12TR.pdf; Supplier 1: Farnell; Supplier Part Number 1: 2849615

## Nets that join several sheets
GND: MAIN_POWER (CON1.6 CON1.12), POWER (22 pins), ACCEL (8 pins)
VBAT: MAIN_POWER (CON1.14), POWER (12 pins)
VGPS: MAIN_POWER (CON1.13), POWER (C3.2 R13.2 U3.5)
VMCU: MAIN_POWER (CON1.5 R11.2 R12.2), POWER (8 pins), ACCEL (C1.2 C2.2 U1.9 U1.10)
A_INT1: MAIN_POWER (CON1.1), ACCEL (U1.12)
A_INT2: MAIN_POWER (CON1.2), ACCEL (U1.11)
BOOST_EN: MAIN_POWER (CON1.7), POWER (R9.1)
GPS_EN: MAIN_POWER (CON1.8), POWER (R8.1)
SCL: MAIN_POWER (CON1.4 R11.1), ACCEL (U1.1)
SDA: MAIN_POWER (CON1.3 R12.1), ACCEL (U1.4)

## Assembly variants
BASIC: all parts fitted